# EasyEDA schematic 0002.json
TITLE: Sheet_1; REV: 1.0; Date: 2020-10-05; Sheet: 1/1; Company: Your Company
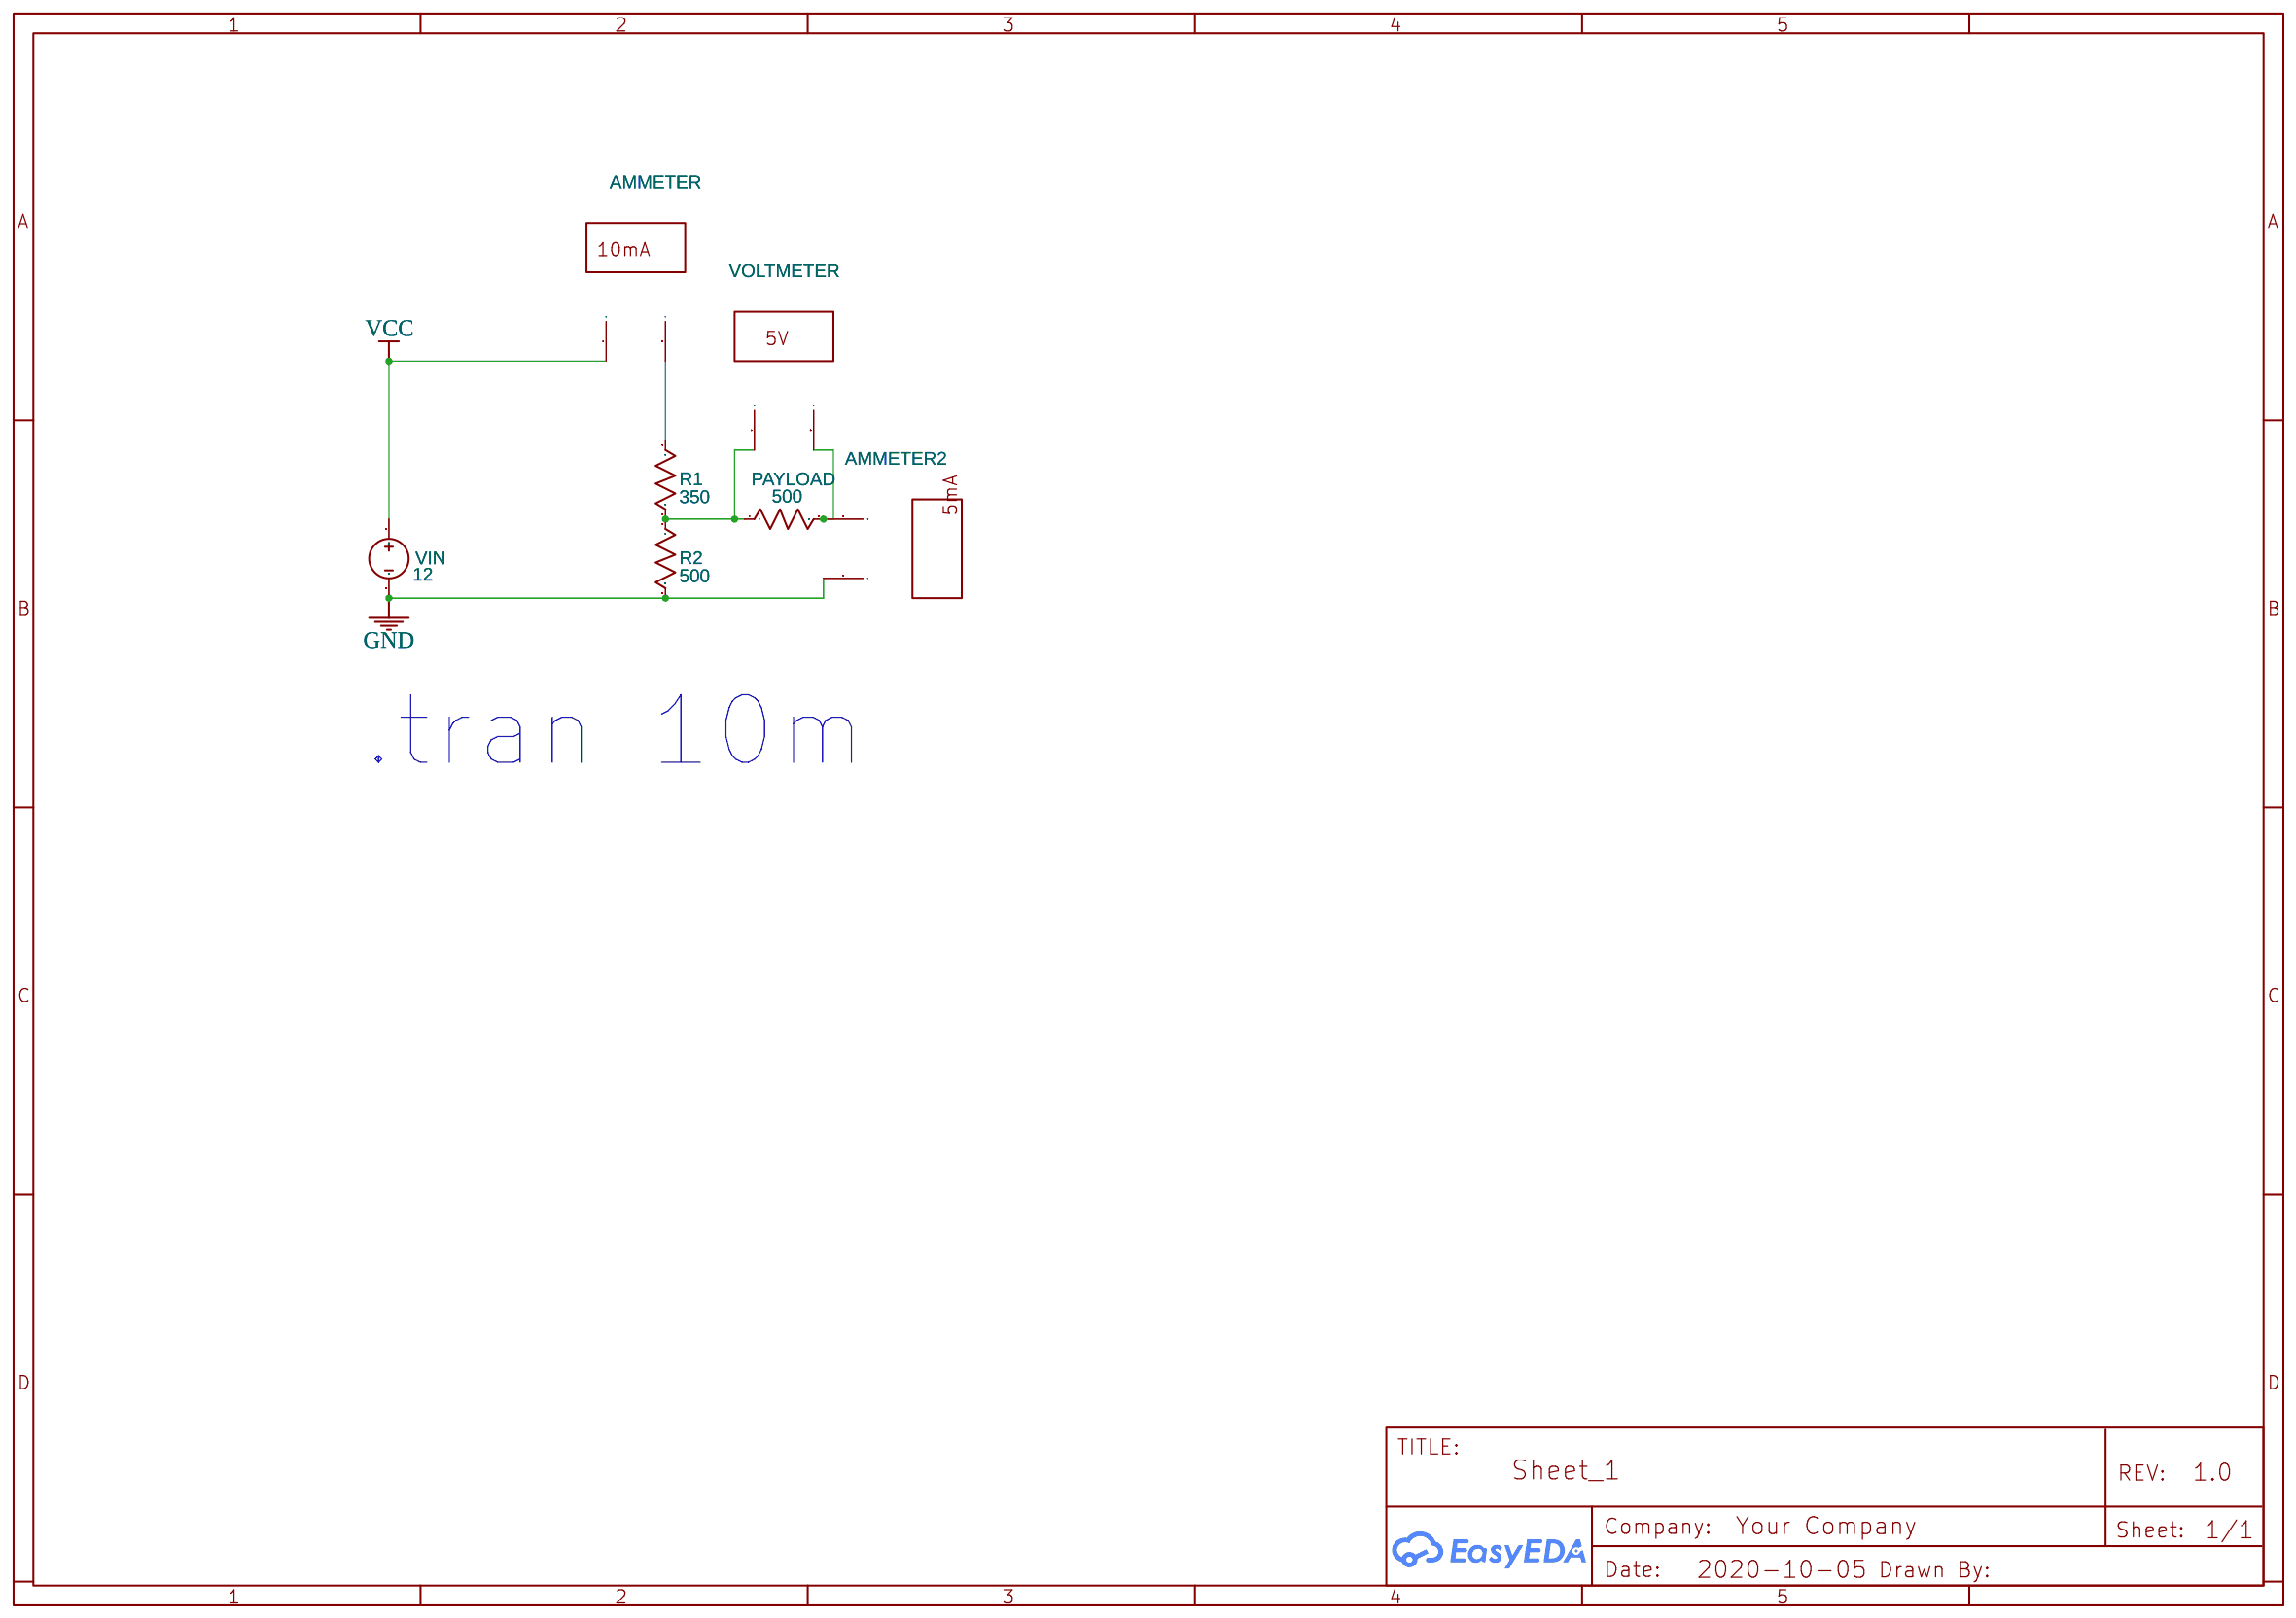
[diagram p0: schematic sheet]

## Parts
AMMETER  Multimeter
AMMETER2  Multimeter
PAYLOAD  500  [AXIAL-0.3]
R1  350  [AXIAL-0.3]
R2  500  [AXIAL-0.3]
VIN  12  [HDR1X2]
VOLTMETER  Multimeter

## Library data of the parts
AMMETER AMMETER2 = MULTIMETER: Supplier: LCSC; Multimeter Type: Amper; Power Type: AC; Voltmeter resistance: 10μ; Ammeter resistance: 1G; NameDisplay: 0; Contributor: EasyEDA; sim: true
PAYLOAD R1 R2 = Resistor_US: Resistance: 1k; Contributor: EasyEDA; Supplier: YUJING
VIN = VDC: Contributor: EasyEDA; sim: true
VOLTMETER = MULTIMETER: Supplier: LCSC; Multimeter Type: Voltmeter; Power Type: AC; Voltmeter resistance: 10μ; Ammeter resistance: 1G; NameDisplay: 0; Contributor: EasyEDA; sim: true

## Nets
GND: AMMETER2.2(I) R2.2 VIN.2
VCC: AMMETER.1(+) VIN.1
Net-(AMMETER2-1): AMMETER2.1(+) PAYLOAD.2 VOLTMETER.2(I)
Net-(AMMETER-2): AMMETER.2(I) R1.1
Net-(PAYLOAD-1): PAYLOAD.1 R1.2 R2.1 VOLTMETER.1(+)

## Notes on the sheet
- .tran 10m
